# Altium project WackyHatProject.PrjPcb
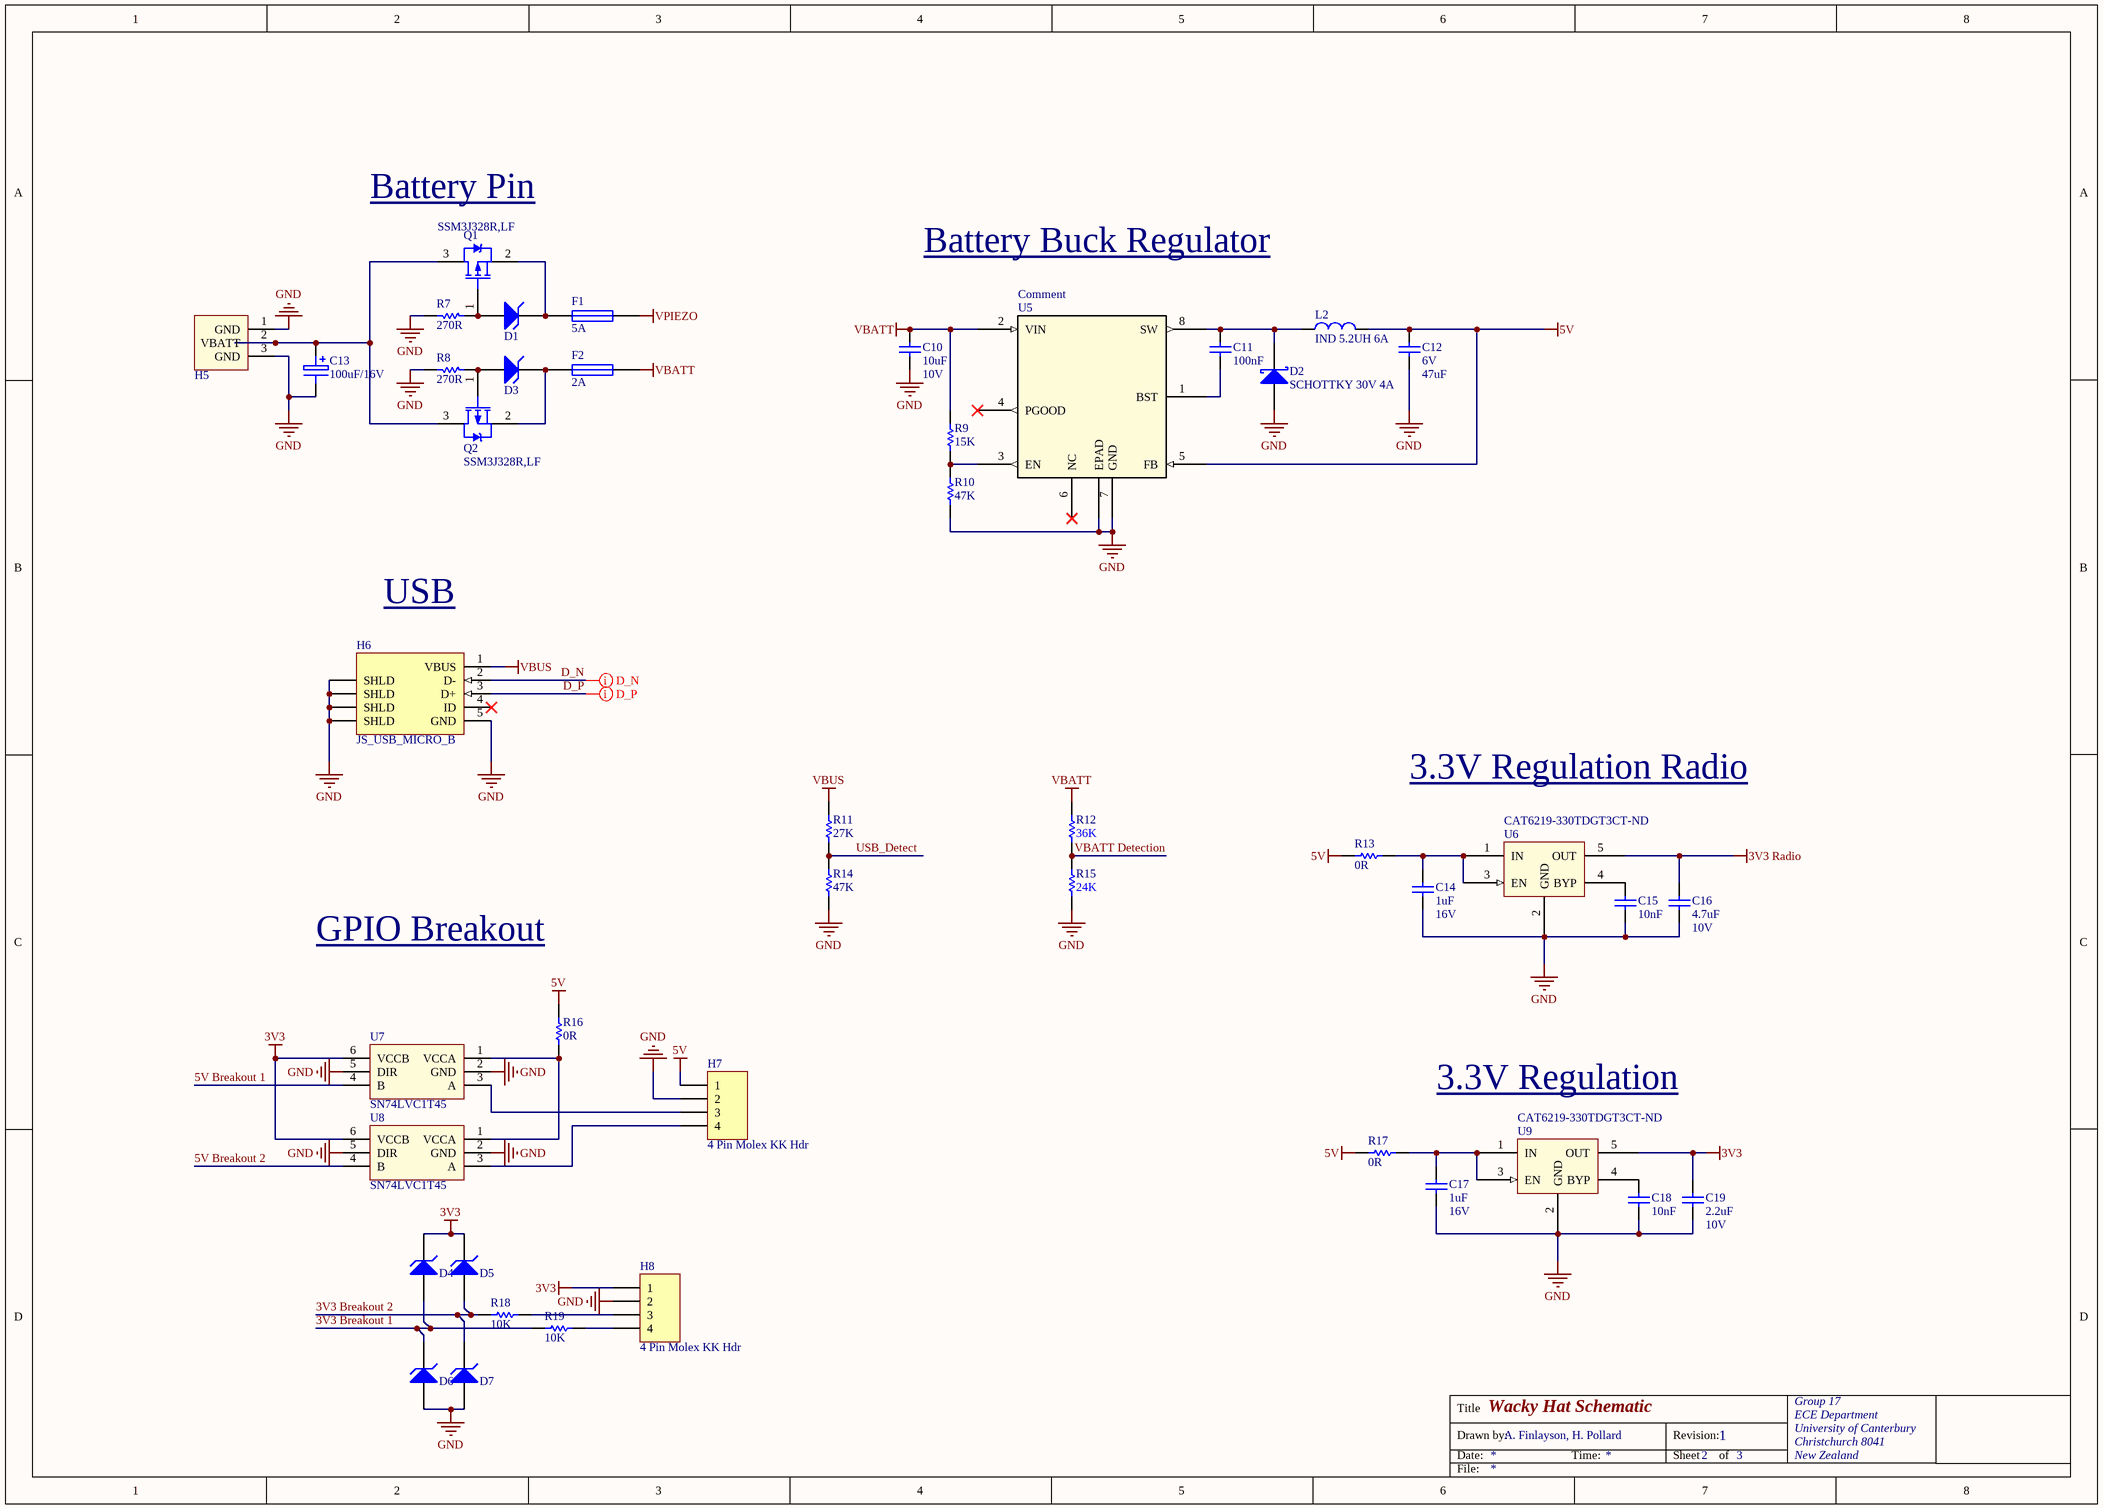
[diagram p0: Power_USB.SchDoc]
3 sheets, 133 parts. Net scope: global (net labels, ports and power ports of the same name join across sheets).
Board file: Hat_Board_PCB.PcbDoc
Sheets:
  Power_USB.SchDoc
  SAM4S_Piezo_LED.SchDoc
  IMU_Radio.SchDoc

## Sheet Power_USB.SchDoc: Wacky Hat Schematic
size A3; DrawnBy: A. Finlayson, H. Pollard; Organization: Group 17; Address1: ECE Department; Address2: University of Canterbury; Address3: Christchurch 8041; Address4: New Zealand; Revision: 1; SheetNumber: 2; SheetTotal: 3

### Parts
C10  Max Voltage: 10V  [CAPC2012L]  (hidden comment: 10uF)
C11  100nF  [CAPC1608L]
C12  Max Voltage: 6V  [CAPC3216L]  (hidden comment: 47uF)
C13  100uF/16V  [NICH-1]
C14  Max Voltage: 16V  [CAPC1608L]  (hidden comment: 1uF)
C15  10nF  [CAPC1608L]
C16  Max Voltage: 10V  [CAPC1608N]  (hidden comment: 4.7uF)
C17  Max Voltage: 16V  [CAPC1608L]  (hidden comment: 1uF)
C18  10nF  [CAPC1608L]
C19  Max Voltage: 10V  [CAPC1608L]  (hidden comment: 2.2uF)
D1  DIODE ZENER 5.6V  [DO-214AA_SCL]  (value not drawn)
D2  SCHOTTKY 30V 4A  [SMC]
D3  DIODE ZENER 5.6V  [DO-214AA_SCL]  (value not drawn)
D4  DIODE ZENER 5.6V  [DO-214AA_SCL]  (value not drawn)
D5  DIODE ZENER 5.6V  [DO-214AA_SCL]  (value not drawn)
D6  DIODE ZENER 5.6V  [DO-214AA_SCL]  (value not drawn)
D7  DIODE ZENER 5.6V  [DO-214AA_SCL]  (value not drawn)
F1  5A  [RESC3216N]
F2  2A  [RESC3216N]
H5  Battery_HEADER_3pin  [BATT_HEADER_3POS]  (value not drawn)
H6  JS_USB_MICRO_B  [FCI_USB_10118194-0001LF]
H7  4 Pin Molex KK Hdr  [MOLEX_KK_4_HDR]
H8  4 Pin Molex KK Hdr  [MOLEX_KK_4_HDR]
L2  IND 5.2UH 6A  [INDUCTOR5u2]
Q1  SSM3J328R,LF  [SOT23_L]
Q2  SSM3J328R,LF  [SOT23_L]
R7  270R  [RESC1608L]
R8  270R  [RESC1608L]
R9  15K  [RESC1608L]
R10  47K  [RESC1608N]
R11  27K  [RESC1608L]
R12  36K  [RESC1608L]
R13  0R  [RESC1608L]
R14  47K  [RESC1608L]
R15  24K  [RESC1608L]
R16  0R  [RESC1608L]
R17  0R  [RESC1608L]
R18  10K  [RESC1608L]
R19  10K  [RESC1608L]
U5  Comment  [RD_8_1]
U6  Supplier Part Number: CAT6219-330TDGT3CT-ND  [SOT95P280X145-5N]  (hidden comment: CAT6219-330TDGT3)
U7  SN74LVC1T45  [SOT23-6_N]
U8  SN74LVC1T45  [SOT23-6_N]
U9  Supplier Part Number: CAT6219-330TDGT3CT-ND  [SOT95P280X145-5N]  (hidden comment: CAT6219-330TDGT3)

### Nets
3V3: C19.2 D4.1(K) D5.1(K) H8.1 U7.6(VCCB) U8.6(VCCB) U9.5(OUT)
3V3 Radio: C16.2 U6.5(OUT)
5V: C12.2 H7.1 L2.2 R13.1 R16.2 R17.1 U5.5(FB)
GND: C10.1 C12.1 C13.1 C14.1 C15.1 C16.1 C17.1 C18.1 C19.1 D2.1(A) D6.2(A) D7.2(A) H5.1(GND) H5.3(GND) H6.5(GND) H6.6(SHLD) H7.2 H8.2 R7.1 R8.1 R10.1 R14.1 R15.1 U5.7(GND) U5.EPAD U6.2(GND) U7.2(GND) U7.5(DIR) U8.2(GND) U8.5(DIR) U9.2(GND)
VBATT: C10.2 F2.2 R9.2 R12.2 U5.2(VIN)
VBUS: H6.1(VBUS) R11.2
VPIEZO: F1.2
3V3 Breakout 1: D4.2(A) D6.1(K) R19.1
3V3 Breakout 2: D5.2(A) D7.1(K) R18.1
5V Breakout 1: U7.4(B)
5V Breakout 2: U8.4(B)
D_N: H6.2(D-)
D_P: H6.3(D+)
USB_Detect: R11.1 R14.2
VBATT Detection: R12.1 R15.2
NetC11_1: C11.1 U5.1(BST)
NetC11_2: C11.2 D2.2(K) L2.1 U5.8(SW)
NetC13_2: C13.2 H5.2(VBATT) Q1.3 Q2.3
NetC14_2: C14.2 R13.2 U6.1(IN) U6.3(EN)
NetC15_2: C15.2 U6.4(BYP)
NetC17_2: C17.2 R17.2 U9.1(IN) U9.3(EN)
NetC18_2: C18.2 U9.4(BYP)
NetD1_1: D1.1(K) F1.1 Q1.2
NetD1_2: D1.2(A) Q1.1 R7.2
NetD3_1: D3.1(K) F2.1 Q2.2
NetD3_2: D3.2(A) Q2.1 R8.2
NetH7_3: H7.3 U7.3(A)
NetH7_4: H7.4 U8.3(A)
NetH8_3: H8.3 R18.2
NetH8_4: H8.4 R19.2
NetR9_1: R9.1 R10.2 U5.3(EN)
NetR16_1: R16.1 U7.1(VCCA) U8.1(VCCA)

Not connected (* = marked no-connect by the designer): H6 4(ID)*; U5 4(PGOOD)* 6(NC)*

### Layout directives
differential pair: D_N, D_P

### Notes on the sheet
- Battery Pin
- Battery Buck Regulator
- USB
- 3.3V Regulation Radio
- GPIO Breakout
- 3.3V Regulation
- Title
- Drawn by:
- Date:
- Time:
- Revision:
- Sheet
- of
- File:

### Library data of the parts
C10 = CC_10uF_0805_10V: CAP CER 10uF X7R +-20% 10V 0805; Note: Footprint corresponds to dimensions for bulk cassette packaging. This case size has tightened tolerances.; PackageReference: 0805; Code_IPC: 2012[0805]; Verify: *; Supplier: ECE Dept; Storage Location: PCB Assembly WS; Value: 10uF
C11 = CC_100nF_0603: CAP CER 100nF X7R +-10% 50V 0603; PackageReference: 0603; Code_IPC: 1608 [0603]; Verify: *; Supplier: ECE Dept; Storage Location: PCB Assembly WS; Value: 100nF
C12 = CC_47uF_1206: CAP CER 47uF X5R -/+20% 6V 1206; Verify: *; Supplier: ECE Dept; Storage Location: PCB Assembly WS; Dielectric: X5R; Footprint: 1210 (3225 metric); MoV: 6V; Value: 47uF
C13 = CA_100uF_16V: CAP ALUM 100uF 16V SMD; Manufacturer PN: UWX1C101MCL1GB; Manufacturer: Nichcon; Supplier 1: Farnell; Supplier Part Number 1: 1870677; Storage Location: PCB Assembly WS; Supplier: ECE Dept; Supplier 2: Digi-Key; Supplier Part Number 2: 493-2105-1-ND; Value: 100uF/16V
C14 C17 = CC_1uF_0603: CAP CER 1uF Y5V -20% +80% 16V 0603; PackageReference: 0603; Code_IPC: 1608 [0603]; Verify: *; Supplier: ECE Dept; Storage Location: PCB Assembly WS; Value: 1uF
C15 C18 = CC_10nF_0603: CAP CER 10nF X7R +-10% 50V 0603; PackageReference: 0603; Code_IPC: 1608 [0603]; Verify: *; Supplier: ECE Dept; Storage Location: PCB Assembly WS; Value: 10nF
C16 = CC_4.7uF_0603: CAP CER 4.7uF X5R +-20%  10V 0603; Note: Footprint corresponds to dimensions for bulk cassette packaging. This case size has tightened tolerances.; PackageReference: 0805; Code_IPC: 2012[0805]; Verify: *; Supplier: ECE Dept; Storage Location: PCB Assembly WS; Value: 4.7uF
C19 = CC_2.2uF_0603: CAP CER 2.2uF X5R +-20% 10V 0603; PackageReference: 0603; Code_IPC: 1608 [0603]; Verify: *; Supplier: ECE Dept; Storage Location: PCB Assembly WS; Value: 2.2uF
D1 D3-D7 = SMBJ5339B-TP: DIODE ZENER 5.6V 5W DO214AA; Manufacturer: Micro Commercial Co; Tolerance: ±5%; Supplier 1: Digi-Key; Manufacturer Part Number: SMBJ5339B-TP; RoHS: RoHS Compliant; Category: Discrete Semiconductor Products; Stock 1: 85990; Pricing 1: 1=1.47, 10=1.277, 25=1.1312, 100=0.9853, 250=0.85764, 500=0.72988, 1000=0.58391 (NZD); Packaging: Cut Tape (CT); Part Status: Active; Operating Temperature: -55°C ~ 150°C; Mounting Type: Surface Mount; Package / Case: DO-214AA, SMB; Supplier Device Package: DO-214AA (SMB); Base Part Number: SMBJ5339; ComponentLink1URL: http://www.mccsemi.com/up_pdf/SMBJ5338B-SMBJ5388B(SMB).pdf; ComponentLink1Description: http://www.mccsemi.com/up_pdf/SMBJ5338B-SMBJ5388B(SMB).pdf; Supplier Part Number 1: SMBJ5339B-TPMSCT-ND
D2 = MBRS330T3G: DIODE SCHOTTKY 30V 4A SMC; Manufacturer: ON Semiconductor; Speed: Fast Recovery =< 500ns, > 200mA (Io); Supplier 1: Digi-Key; Manufacturer Part Number: MBRS330T3G; RoHS: RoHS Compliant; Category: Discrete Semiconductor Products; Stock 1: 8919; Pricing 1: 1=0.93, 10=0.79, 100=0.5902, 500=0.46368, 1000=0.35829 (NZD); Packaging: Cut Tape (CT); Part Status: Active; Diode Type: Schottky; Current - Average Rectified (Io): 4A; Capacitance @ Vr, F: -; Mounting Type: Surface Mount; Package / Case: DO-214AB, SMC; Supplier Device Package: SMC; Operating Temperature - Junction: -65°C ~ 150°C; Base Part Number: MBRS330; ComponentLink1URL: http://www.onsemi.com/pub/Collateral/MBRS340T3-D.PDF; ComponentLink1Description: http://www.onsemi.com/pub/Collateral/MBRS340T3-D.PDF; Supplier Part Number 1: MBRS330T3GOSCT-ND
F1 = FS_Fuse_5.0A: Fuse 5.0A Fast Acting 1206 SMD; Manufacturer Part Number: C1F5; Manufacturer: Bel TRP; Voltage Rating (AC): 125V; Voltage Rating (DC): 63V; DC Cold Resistance: 19mR; Fuse Type: Board Mount (Cartridge Style Excluded); Approvals: CE,cURus; Mount: Surface Mount; Case/Package: 1206; Number of Pins: 2; Case Code (Metric): 3216; Case Code (Imperial): 1206; Contact Plating: Nickel,Tin; Min Operating Temperature: -55°C; Max Operating Temperature: 125°C; Packaging: Tape and Reel; Voltage Rating: 125V; Length: 0.126inch; Width: 0.062inch; Supplier 1: Digi-Key; Stock 1: 725; Pricing 1: 1=0.32, 5=0.312, 10=0.298, 50=0.2662, 100=0.2479, 250=0.22032, 500=0.1836, 1000=0.17442 (USD); ComponentLink1URL: http://www.farnell.com/datasheets/2571625.pdf; ComponentLink1Description: http://www.farnell.com/datasheets/2571625.pdf; ComponentLink2URL: http://belfuse.com/pdfs/C1F.pdf; ComponentLink2Description: http://belfuse.com/pdfs/C1F.pdf; ComponentLink3URL: http://www.mouser.com/ds/2/643/C1F-594910.pdf; ComponentLink3Description: http://www.mouser.com/ds/2/643/C1F-594910.pdf; ComponentLink4URL: https://belfuse.com/resources/StewartConnector/C1F.pdf; ComponentLink4Description: https://belfuse.com/resources/StewartConnector/C1F.pdf; Current Rating: 5A; Supplier Part Number 1: 507-1886-1-ND; Supplier 2: Element14; Supplier Part Number 2: 2848595; Value: 5A
F2 = FS_Fuse_2.0A: Fuse 2.0A Very Fast Acting 1206 SMD; Manufacturer: MULTICOMP; Manufacturer PN: MC12CF 002; Supplier: ECE Dept; Storage Location: PCB Assembly WS; Supplier 1: Farnell; Supplier Part Number 1: 1841029; Manufacturer Part Number: MC12CF 002; Value: 2A
H5 = Battery_HEADER_3pin: 3Pin Header 2.54mm spacing
H6 = JS_USB_MICRO_B_SMT: CONN USB MICRO B RECPT SMT R/A; Manufacturer: FCI; Manufacturer Part Number: 10118194-0001LF; Gender: Receptacle; Number of Contacts: 5; Specifications: USB 2.0; Supplier 1: Digi-Key; Supplier Part Number 1: 609-4618-1-ND; Features: Shielded, Solder Retention; Mounting Type: Surface Mount, Right Angle, Horizontal
H7 H8 = JA_MOLEX_KK_4POS: CONN HEADER 4POS 2.54mm VERT_Thru Hole; Manufacturer: Molex; Manufacturer PN: 22-23-2041; Supplier Part Number 1: 9731164; Supplier: ECE Dept; Supplier 1: Farnell; Storage Location: ECE Dept Store; Value: 4 Pin Molex KK Hdr
L2 = CDRH104RNP-5R2NC: FIXED IND 5.2UH 6A 22 MOHM SMD; Manufacturer: Sumida America Components Inc.; Material - Core: Ferrite; Tolerance: ±30%; Current - Saturation: 5.6A; Shielding: Shielded; DC Resistance (DCR): 22 mOhm Max; Supplier 1: Digi-Key; Manufacturer Part Number: CDRH104RNP-5R2NC; RoHS: RoHS Compliant; Category: Inductors, Coils, Chokes; Stock 1: 3849; Pricing 1: 1=2.9, 10=2.678, 100=1.8743, 500=1.5173 (NZD); Packaging: Cut Tape (CT); Part Status: Active; Type: -; Q @ Freq: -; Frequency - Self Resonant: -; Ratings: -; Operating Temperature: -40°C ~ 100°C; Mounting Type: Surface Mount; Package / Case: Nonstandard; Supplier Device Package: -; Size / Dimension: 0.402" L x 0.394" W (10.20mm x 10.00mm); Height - Seated (Max): 0.157" (4.00mm); ComponentLink1URL: http://products.sumida.com/products/pdf/CDRH104R.pdf; ComponentLink1Description: http://products.sumida.com/products/pdf/CDRH104R.pdf; Supplier Part Number 1: 308-2280-1-ND
Q1 Q2 = TM_SSM3J328R: MOSFET P-CH 20V 6A SOT23-3; Manufacturer: Toshiba; FET Feature: Logic Level Gate, 1.5V Drive; FET Type: MOSFET P-Channel, Metal Oxide; Gate Charge (Qg) @ Vgs: 12.8nC @ 4.5V; Input Capacitance (Ciss) @ Vds: 840pF @ 10V; Power - Max: 1W; Rds On Max: 29.8mR; Drain to Source Resistance: 47.4mR; Turn-On Delay Time: 32ns; Power Dissipation: 2W; Number of Channels: 1; Turn-Off Delay Time: 107ns; Gate to Source Voltage (Vgs): 8V; Input Capacitance: 840pF; Element Configuration: Single; Drain to Source Breakdown Voltage: -20V; Vgs(th) (Max) @ Id: 1V @ 1mA; Current - Continuous Drain (Id) @ 25° C: 6A; Drain to Source Voltage (Vdss): 20V; Package / Case: SOT-23-3 Flat Leads; Supplier Device Package: SOT-23F; Pricing: 1=0.79, 10=0.658, 25=0.5772, 100=0.4939, 250=0.42836, 500=0.36284, 1000=0.27972 (NZD); Storage Location: PCB Assembly WS; Supplier: Digi-Key; ComponentLink1URL: https://datasheet.ciiva.com/11158/ssm3j328r-datasheet-en-20140301-11158652.pdf; ComponentLink1Description: https://datasheet.ciiva.com/11158/ssm3j328r-datasheet-en-20140301-11158652.pdf; Supplier Part Number: SSM3J328RLFDKR-ND; Max Operating Temperature: 150°C; Mount: Surface Mount; Packaging: Tape and Reel; Min Operating Temperature: -55°C; Continuous Drain Current (ID): 6A; Radiation Hardening: No; Max Power Dissipation: 1W; Package Quantity: 3000; Case/Package: SOT-23-3; Number of Pins: 3; Number of Elements: 1; Supplier 1: Digi-Key; Supplier Part Number 1: SSM3J328RLFDKR-ND; Manufacturer Part Number: SSM3J328R,LF
R7 R8 = RS_270R: RES 270 OHM 1/10W 5% 0603 SMD; Storage Location: PCB Assembly WS; Supplier: ECE Dept; Value: 270R
R9 = RS_15K: RES 15.0K OHM 1/10W 5% 0603 SMD; Storage Location: PCB Assembly WS; Supplier: ECE Dept; Value: 15K
R10 R14 = RS_47K: RES 47.0K OHM 1/10W 5% 0603 SMD; Storage Location: PCB Assembly WS; Supplier: ECE Dept; Value: 47K
R11 = RS_27K: RES 27K OHM 1/10W 5% 0603 SMD; Storage Location: PCB Assembly WS; Supplier: ECE Dept; Value: 27K
R12 = RS_36K: RES 36K OHM 1/10W 5% 0603 SMD; Storage Location: PCB Assembly WS; Supplier: ECE Dept; Value: 36K
R13 R16 R17 = RS_0R0: RES 0.0 OHM 1/10W 5% 0603 SMD; Storage Location: PCB Assembly WS; Supplier: ECE Dept; Value: 0R
R15 = RS_24K: RES 24K OHM 1/10W 5% 0603 SMD; Storage Location: PCB Assembly WS; Supplier: ECE Dept; Value: 24K
R18 R19 = RS_10K: RES 10.0K OHM 1/10W 5% 0603 SMD; Storage Location: PCB Assembly WS; Supplier: ECE Dept; Value: 10K
U5 = ADP2302ARDZ-5.0-R7: IC REG BUCK 5V 2A 8SOIC; Vendor: Analog Devices Inc; Frequency - Switching: 700kHz; Output Type: Fixed; Voltage - Input (Max): 20V; Manufacturer_Part_Number: ADP2302ARDZ-5.0-R7; Type: DEV; Value: Value; Supplier 1: Digi-Key; Current - Output: 2A; Voltage - Output (Min/Fixed): 5V; Supplier Part Number 1: ADP2302ARDZ-5.0-R7CT-ND
U6 U9 = SV_CAT6219-330TDGT3: IC REG LIN 3.3V 500MA TSOT23-5; Voltage - Input (Max): 5.5V; Voltage Dropout (Max): 0.5V @ 500mA; Manufacturer Part Number: CAT6219-330TDGT3; Base Part Number: CAT6219; Current - Output: 500mA; Package / Case: SOT-23-5 Thin, TSOT-23-5; Supplier: Digi-Key; Supplier Device Package: TSOT-23-5; Voltage - Output (Min/Fixed): 3.3V; ComponentLink1URL: http://www.onsemi.com/pub/Collateral/CAT6219-D.PDF; ComponentLink1Description: http://www.onsemi.com/pub/Collateral/CAT6219-D.PDF; Supplier 1: Digi-Key
U7 U8 = SN74LVC1T45: 1.8V - 5V level converter

## Sheet SAM4S_Piezo_LED.SchDoc: Wacky Hat Schematic
size A3; DrawnBy: A. Finlayson, H. Pollard; Organization: Group 17; Address1: ECE Department; Address2: University of Canterbury; Address3: Christchurch 8041; Address4: New Zealand; Revision: 1; SheetNumber: 3; SheetTotal: 3
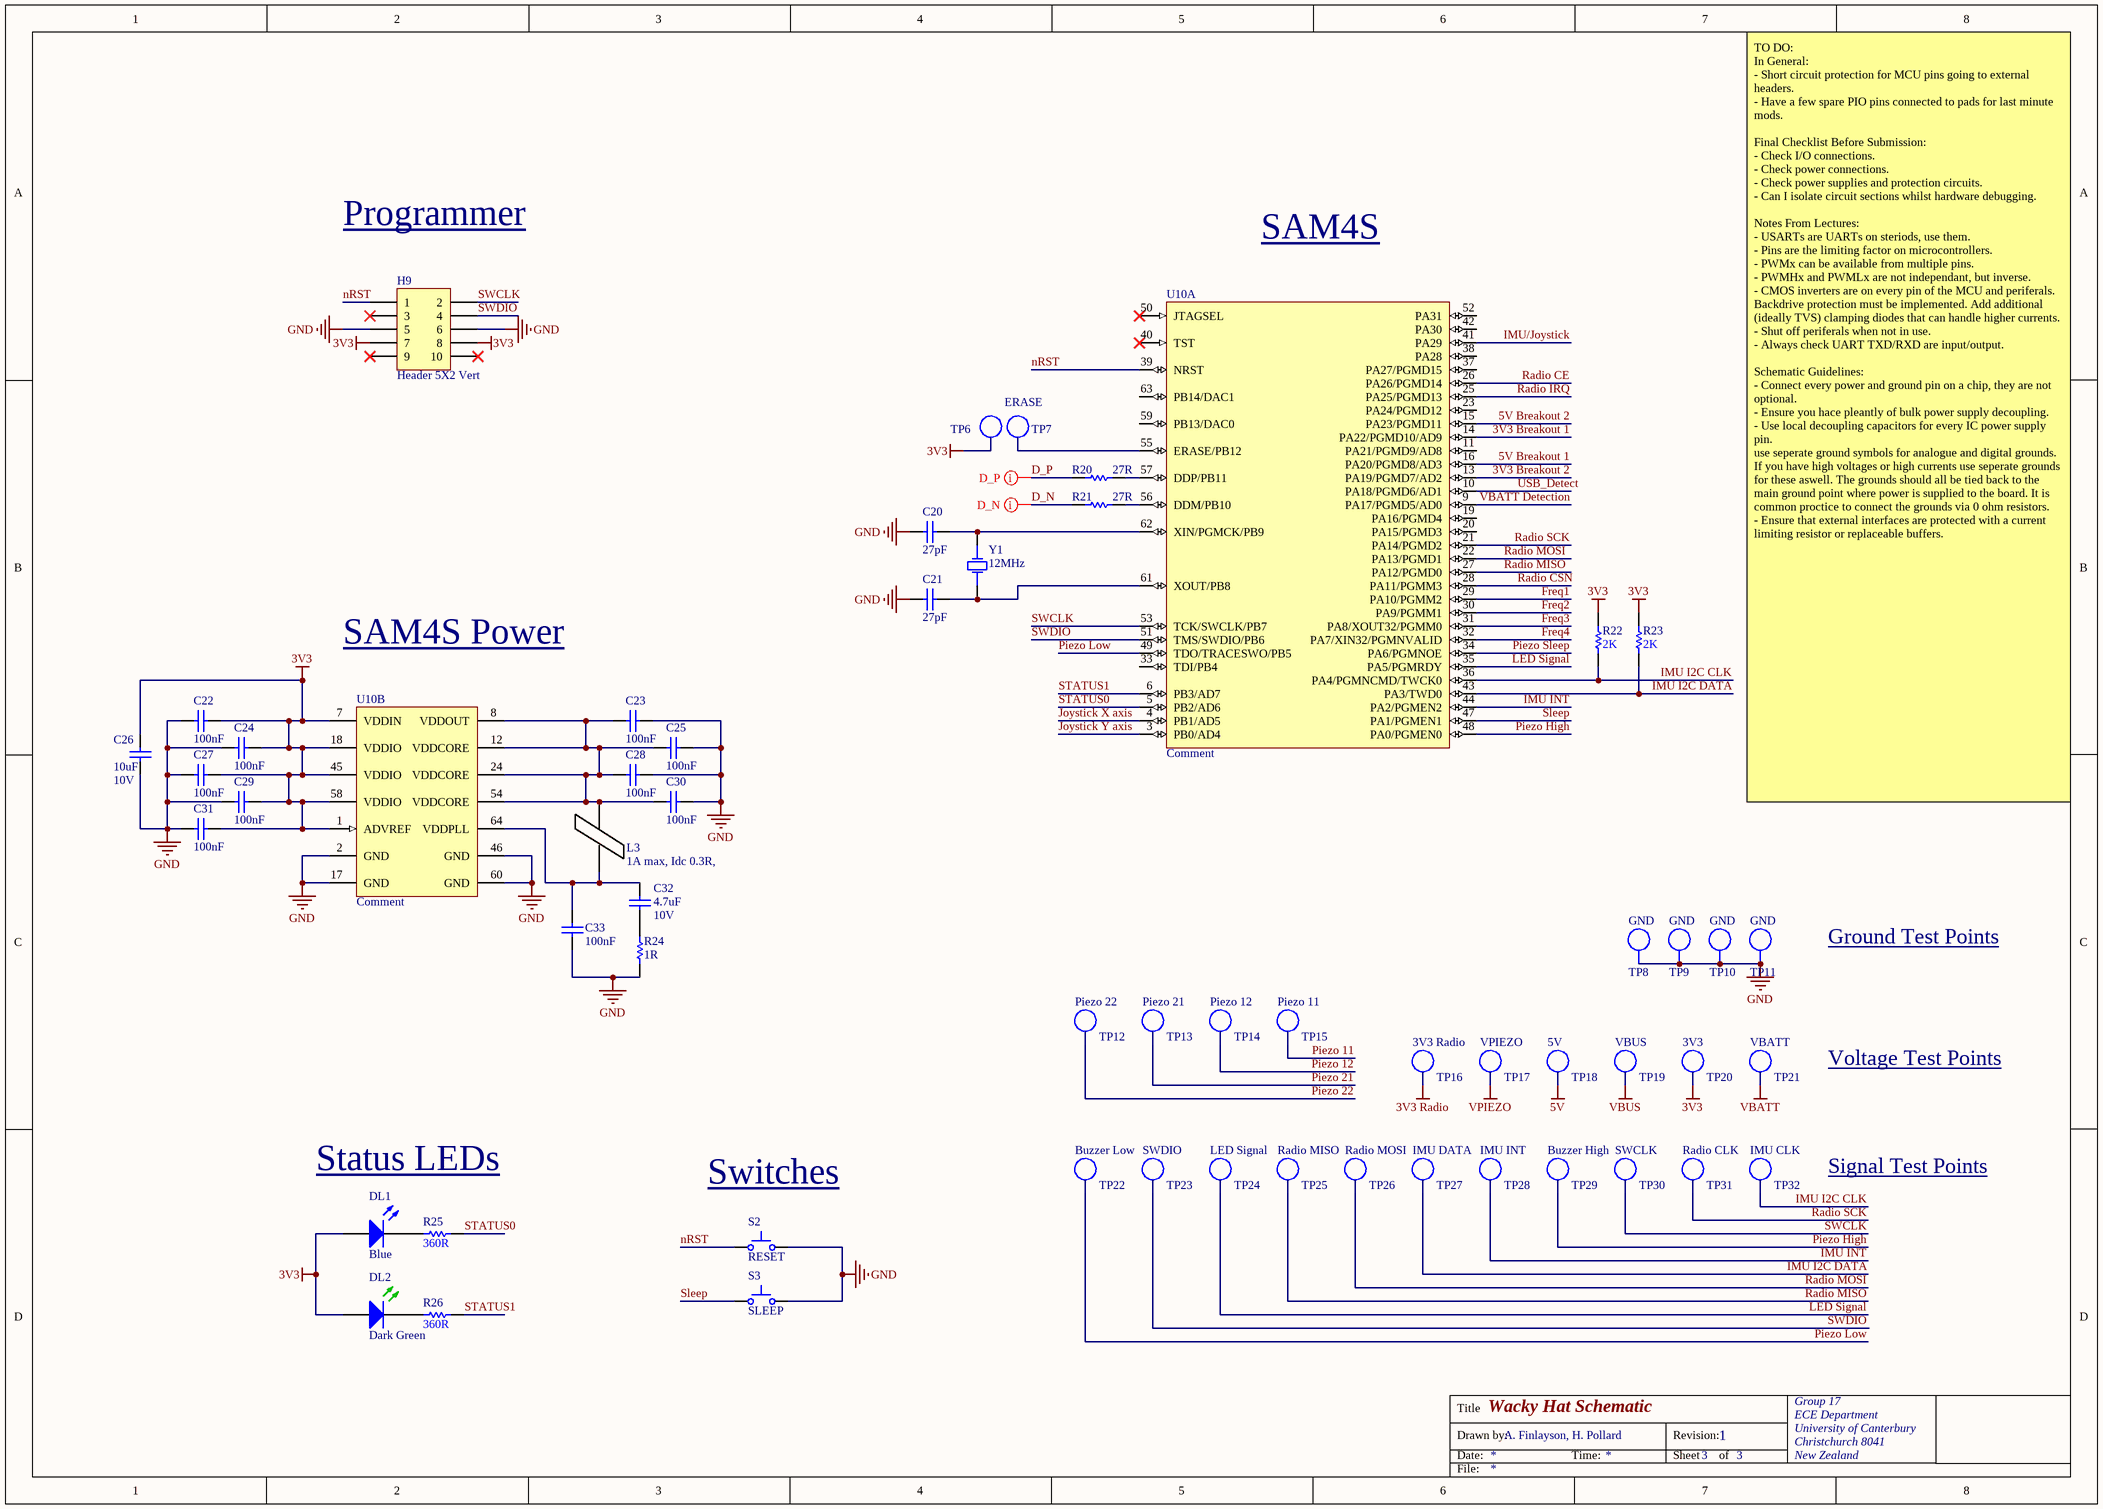
[diagram p1: SAM4S_Piezo_LED.SchDoc]

### Parts
C20  27pF  [CAPC1608L]
C21  27pF  [CAPC1608L]
C22  100nF  [CAPC1608L]
C23  100nF  [CAPC1608L]
C24  100nF  [CAPC1608L]
C25  100nF  [CAPC1608L]
C26  Max Voltage: 10V  [CAPC2012L]  (hidden comment: 10uF)
C27  100nF  [CAPC1608L]
C28  100nF  [CAPC1608L]
C29  100nF  [CAPC1608L]
C30  100nF  [CAPC1608L]
C31  100nF  [CAPC1608L]
C32  Max Voltage: 10V  [CAPC1608N]  (hidden comment: 4.7uF)
C33  100nF  [CAPC1608L]
DL1  Blue  [WL-SMCW0603]
DL2  Dark Green  [WL-SMCW0603]
H9  Header 5X2 Vert  [IDC2.54-V10D]
L3  1A max, Idc 0.3R,  [INDC3216L]
R20  27R  [RESC1608L]
R21  27R  [RESC1608L]
R22  2K  [RESC1608L]
R23  2K  [RESC1608L]
R24  1R  [RESC3216L]
R25  360R  [RESC1608L]
R26  360R  [RESC1608L]
S2  RESET  [EVQPNF05M]
S3  SLEEP  [EVQPNF05M]
TP6  TP_0603  [TP_0603]  (value not drawn)
TP7  ERASE  [TP_0603]
TP8  GND  [TP_1206]  (no BOM)
TP9  GND  [TP_1206]  (no BOM)
TP10  GND  [TP_1206]  (no BOM)
TP11  GND  [TP_1206]  (no BOM)
TP12  Piezo 22  [TP_0603]
TP13  Piezo 21  [TP_0603]
TP14  Piezo 12  [TP_0603]
TP15  Piezo 11  [TP_0603]
TP16  3V3 Radio  [TP_0603]
TP17  VPIEZO  [TP_0603]
TP18  5V  [TP_0603]
TP19  VBUS  [TP_0603]
TP20  3V3  [TP_0603]
TP21  VBATT  [TP_0603]
TP22  Buzzer Low  [TP_0603]
TP23  SWDIO  [TP_0603]
TP24  LED Signal  [TP_0603]
TP25  Radio MISO  [TP_0603]
TP26  Radio MOSI  [TP_0603]
TP27  IMU DATA  [TP_0603]
TP28  IMU INT  [TP_0603]
TP29  Buzzer High  [TP_0603]
TP30  SWCLK  [TP_0603]
TP31  Radio CLK  [TP_0603]
TP32  IMU CLK  [TP_0603]
U10  Comment  [LQFP64_L]  (parts A,B of 2)
Y1  12MHz  [6.0X3.5-4]

### Nets
3V3: C22.2 C24.2 C26.2 C27.2 C29.2 C31.2 DL1.2(A) DL2.2(A) H9.7 H9.8 R22.2 R23.2 TP6.1(TP) TP20.1(TP) U10.1(ADVREF) U10.7(VDDIN) U10.18(VDDIO) U10.45(VDDIO) U10.58(VDDIO)
3V3 Radio: TP16.1(TP)
5V: TP18.1(TP)
GND: C20.1 C21.1 C22.1 C23.2 C24.1 C25.2 C26.1 C27.1 C28.2 C29.1 C30.2 C31.1 C33.1 H9.5 H9.6 R24.1 S2.2 S3.2 TP8.1 TP9.1 TP10.1 TP11.1 U10.2(GND) U10.17(GND) U10.46(GND) U10.60(GND)
VBATT: TP21.1(TP)
VBUS: TP19.1(TP)
VPIEZO: TP17.1(TP)
3V3 Breakout 1: U10.14(PA22/PGMD10/AD9)
3V3 Breakout 2: U10.13(PA19/PGMD7/AD2)
5V Breakout 1: U10.16(PA20/PGMD8/AD3)
5V Breakout 2: U10.15(PA23/PGMD11)
D_N: R21.1
D_P: R20.1
Freq1: U10.29(PA10/PGMM2)
Freq2: U10.30(PA9/PGMM1)
Freq3: U10.31(PA8/XOUT32/PGMM0)
Freq4: U10.32(PA7/XIN32/PGMNVALID)
IMU I2C CLK: R22.1 TP32.1(TP) U10.36(PA4/PGMNCMD/TWCK0)
IMU I2C DATA: R23.1 TP27.1(TP) U10.43(PA3/TWD0)
IMU INT: TP28.1(TP) U10.44(PA2/PGMEN2)
IMU/Joystick: U10.41(PA29)
Joystick X axis: U10.4(PB1/AD5)
Joystick Y axis: U10.3(PB0/AD4)
LED Signal: TP24.1(TP) U10.35(PA5/PGMRDY)
nRST: H9.1 S2.1 U10.39(NRST)
Piezo 11: TP15.1(TP)
Piezo 12: TP14.1(TP)
Piezo 21: TP13.1(TP)
Piezo 22: TP12.1(TP)
Piezo High: TP29.1(TP) U10.48(PA0/PGMEN0)
Piezo Low: TP22.1(TP) U10.49(TDO/TRACESWO/PB5)
Piezo Sleep: U10.34(PA6/PGMNOE)
Radio CE: U10.26(PA26/PGMD14)
Radio CSN: U10.28(PA11/PGMM3)
Radio IRQ: U10.25(PA25/PGMD13)
Radio MISO: TP25.1(TP) U10.27(PA12/PGMD0)
Radio MOSI: TP26.1(TP) U10.22(PA13/PGMD1)
Radio SCK: TP31.1(TP) U10.21(PA14/PGMD2)
Sleep: S3.1 U10.47(PA1/PGMEN1)
STATUS0: R25.2 U10.5(PB2/AD6)
STATUS1: R26.2 U10.6(PB3/AD7)
SWCLK: H9.2 TP30.1(TP) U10.53(TCK/SWCLK/PB7)
SWDIO: H9.4 TP23.1(TP) U10.51(TMS/SWDIO/PB6)
USB_Detect: U10.10(PA18/PGMD6/AD1)
VBATT Detection: U10.9(PA17/PGMD5/AD0)
NetC20_2: C20.2 U10.62(XIN/PGMCK/PB9) Y1.3(OSC2)
NetC21_2: C21.2 U10.61(XOUT/PB8) Y1.1(OSC1)
NetC23_1: C23.1 C25.1 C28.1 C30.1 L3.2 U10.8(VDDOUT) U10.12(VDDCORE) U10.24(VDDCORE) U10.54(VDDCORE)
NetC32_1: C32.1 R24.2
NetC32_2: C32.2 C33.2 L3.1 U10.64(VDDPLL)
NetDL1_1: DL1.1(K) R25.1
NetDL2_1: DL2.1(K) R26.1
NetR20_2: R20.2 U10.57(DDP/PB11)
NetR21_2: R21.2 U10.56(DDM/PB10)
NetTP7_1: TP7.1(TP) U10.55(ERASE/PB12)

Not connected (* = marked no-connect by the designer): H9 3* 9* 10*; U10 11(PA21/PGMD9/AD8) 19(PA16/PGMD4) 20(PA15/PGMD3) 23(PA24/PGMD12) 33(TDI/PB4) 37(PA27/PGMD15) 38(PA28) 40(TST)* 42(PA30) 50(JTAGSEL)* 52(PA31) 59(PB13/DAC0) 63(PB14/DAC1)

### Layout directives
differential pair: D_N, D_P

### Notes on the sheet
- Programmer
- SAM4S
- SAM4S Power
- TO DO:
  In General:
  - Short circuit protection for MCU pins going to external headers.
  - Have a few spare PIO pins connected to pads for last minute mods.
  Final Checklist Before Submission:
  - Check I/O connections.
  - Check power connections.
  - Check power supplies and protection circuits.
  - Can I isolate circuit sections whilst hardware debugging.
  Notes From Lectures:
  - USARTs are UARTs on steriods, use them.
  - Pins are the limiting factor on microcontrollers.
  - PWMx can be available from multiple pins.
  - PWMHx and PWMLx are not independant, but inverse.
  - CMOS inverters are on every pin of the MCU and periferals. Backdrive protection must be implemented. Add additional (ideally TVS) clamping diodes that can handle higher currents.
  - Shut off periferals when not in use.
  - Always check UART TXD/RXD are input/output.
  Schematic Guidelines:
  - Connect every power and ground pin on a chip, they are not optional.
  - Ensure you hace pleantly of bulk power supply decoupling.
  - Use local decoupling capacitors for every IC power supply pin.
  use seperate ground symbols for analogue and digital grounds. If you have high voltages or high currents use seperate grounds for these aswell. The grounds should all be tied back to the main ground point where power is supplied to the board. It is common proctice to connect the grounds via 0 ohm resistors.
  - Ensure that external interfaces are protected with a current limiting resistor or replaceable buffers.
- Ground Test Points
- Voltage Test Points
- Status LEDs
- Switches
- Signal Test Points
- Title
- Drawn by:
- Date:
- Time:
- Revision:
- Sheet
- of
- File:

### Library data of the parts
C20 C21 = CC_27pF_0603: CAP CER 27pF NPO/COG +-5% 50V 0603; PackageReference: 0603; Code_IPC: 1608 [0603]; Verify: *; Supplier: ECE Dept; Storage Location: PCB Assembly WS; Value: 27pF
C22-C25 C27-C31 C33 = CC_100nF_0603: CAP CER 100nF X7R +-10% 50V 0603; PackageReference: 0603; Code_IPC: 1608 [0603]; Verify: *; Supplier: ECE Dept; Storage Location: PCB Assembly WS; Value: 100nF
C26 = CC_10uF_0805_10V: as C10 on sheet Power_USB; PackageReference: 0805; Code_IPC: 2012[0805]; Verify: *; Supplier: ECE Dept; Storage Location: PCB Assembly WS; Value: 10uF
C32 = CC_4.7uF_0603: as C16 on sheet Power_USB; PackageReference: 0805; Code_IPC: 2012[0805]; Verify: *; Supplier: ECE Dept; Storage Location: PCB Assembly WS; Value: 4.7uF
DL1 = DL_150060BS75000: LED Blue 270mcd 0603 SMD; Manufacturer: WURTH ELEKTRONIK; Forward Current If: 30; Forward Voltage: 3.2; Luminous Intensity: 270; Viewing Angle: 120°; Wavelength Typ: 470; Pricing: 1=0.3844, 50=0.3252, 100=0.2957, 500=0.2365 (NZD); Supplier 1: Farnell; Supplier Part Number 1: 2322069; Manufacturer Part Number: 150060BS75000; Storage Location: PCB Assembly WS; Supplier: ECE Dept; LED Colour: Blue
DL2 = DL_150060GS75000: LED Dk Green 430mcd 0603 SMD; Manufacturer: WURTH ELEKTRONIK; Forward Current If: 30; Wavelength Typ: 520; Forward Voltage: 3.2; Lens Shape: Rectangular; Luminous Intensity: 430; Viewing Angle: 140°; LED Mounting: SMD; Supplier 1: Farnell; Supplier Part Number 1: 2322070; Manufacturer Part Number: 150060GS75000; Storage Location: PCB Assembly WS; Supplier: ECE Dept; LED Colour: Dark Green
H9 = JA_HDR_IDC_5X2_VERT: IDC Header, 2,54mm, 10-Pin, Vert; Supplier: ECE Dept; Supplier 1: Farnell; Supplier Part Number 1: 1096985; Storage Location: ECE Dept Store
L3 = IN_Ferrite-Bead: Ferrite Bead, Rdc 0.3R, Z100MHZ 600R, Imax 1A, SMD 1206; Manufacturer: FAIR-RITE; Manufacturer PN: 2512066017Y1; DC Current Rating: 1; DC Resistance Max: 0.08; Ferrite Case Style: 1206 ^3216 Metric]; Frequency Range: 50MHz to 1; Impedance: 600; Impedance Tolerance: ± 25%; Supplier: ECE Dept; Storage Location: PCB Assembly WS; Ferrite Mounting: SMD; Supplier 1: Farnell; Supplier Part Number 1: 1612060; Manufacturer Part Number: 2512066017Y1; Value: 1A max, Idc 0.3R,
R20 R21 = RS_27R: RES 27 OHM 1/10W 5% 0603 SMD; Storage Location: PCB Assembly WS; Supplier: ECE Dept; Value: 27R
R22 R23 = RS_2K: RES 2K OHM 1/10W 5% 0603 SMD; Storage Location: PCB Assembly WS; Supplier: ECE Dept; Value: 2K
R24 = RT_1R: RES 1R OHM 1/4W 5% 1206 SMD; Storage Location: PCB Assembly WS; Supplier: ECE Dept; Value: 1R
R25 R26 = RS_360R: RES 360 OHM 1/10W 5% 0603 SMD; Storage Location: PCB Assembly WS; Supplier: ECE Dept; Value: 360R
S2 S3 = WS_EVQPNF05M: Panasonic 6 x 3.5mm SMD Light Touch Switch Type SMD; PackageDescription: 6.0 x 3.5 mm; Supplier 1: Farnell; Supplier Part Number 1: 2079481; Manufacturer: Panasonic; Manufacturer PN: EVQPNF05M; Supplier 2: Digi-Key; Supplier Part Number 2: P13598SCT-ND; Storage Location: PCB Assembly WS; Supplier: ECE Dept
TP6 TP7 TP12-TP32 = TP_0603: Test Point 1.65X0.9X1.2mm SMD; Manufacturer: TE Connectivity AMP Connectors; Manufacturer Part Number: 1625854-3; Mounting Type: Surface Mount; Type: PC Test Point; Supplier 1: Digi-Key; Supplier Part Number 1: A106145CT-ND; Terminal: 0.063" x 0.031" x 0.045" (1.60mm x 0.80mm x 1.15mm)
TP8-TP11 = TP_1206: Test-Point 3.3x1.6x2.1mm SMD; Manufacturer: Harwin Inc; Manufacturer Part Number: S1751-46R; Value: TP; Manufacturer PN: *; Storage Location: ProtoPlace; Mounting Type: Surface Mount; Type: PC Test Point; Supplier 1: Digi-Key; Supplier Part Number 1: 952-1478-2-ND; Supplier 2: Farnell; Supplier Part Number 2: 1826282; Supplier: ECE Dept
U10 = SE_ATSAM4S16BA-MU: IC MCU 32BIT 512KB FLASH 64LQFP; Manufacturer: Atmel; Manufacturer Part Number: ATSAM4S8BA-ANR; Connectivity: I²C, IrDA, Memory Card, SPI, SSC, UART/USART, USB; Core Processor: ARM® Cortex®-M4; Core Size: 32-Bit; Data Converters: A/D 11x12b, D/A 2x12b; Number of I/O: 47; Peripherals: Brown-out Detect/Reset, DMA, POR, PWM, WDT; Program Memory Size: 512KB (512K x 8); RAM Size: 128K x 8; Speed: 120MHz; Voltage - Supply (Vcc/Vdd): 1.62 V ~ 3.6 V; PackageVersion: revJ, Jul-2007; PackageReference: 64PS; PackageDescription: 64-Pin Quad Flat No-Lead (QFN) Sawn, 9 x 9 x 1.0 mm Body, 0.5 mm Pitch, Exposed Pad; Code_JEDEC: MO-220VMMD-3; ComponentLink1Description: Manufacturer URL; ComponentLink1URL: http://www.atmel.com/; ComponentLink2Description: SAM4S Series Datasheet; ComponentLink2URL: http://www.atmel.com/dyn/resources/prod_documents/11100.pdf; ComponentLink3Description: SAM4S Series Summary; ComponentLink3URL: http://www.atmel.com/dyn/resources/prod_documents/11100S.pdf; Supplier 1: Digi-Key; Package / Case: 64-LQFP; Packaging: Cut Tape (CT); Program Memory Type: FLASH; Supplier Part Number 1: ATSAM4S8BA-ANRCT-ND
Y1 = XT_CRYSTAL_12MHz_18pF: CRYSTAL 12MHZ 18PF 6X3.5mm SMD; Manufacturer: CTS-Frequency Controls; Manufacturer Part Number: 406C35D12M00000; ESR (Equivalent Series Resistance): 60 Ohm; Frequency Stability: ±50ppm; Frequency Tolerance: ±30ppm; Operating Mode: Fundamental; Supplier 1: Digi-Key; Height: 0.047" (1.20mm); Load Capacitance: 18pF; Mounting Type: Surface Mount; Operating Temperature: -20°C ~ 70°C; Package / Case: 4-SMD, No Lead (DFN, LCC); Size / Dimension: 0.236" L x 0.138" W (6.00mm x 3.50mm); Supplier Part Number 1: CTX855CT-ND; Frequency: 12MHz

## Sheet IMU_Radio.SchDoc: Wacky Hat Schematic
size A3; DrawnBy: A. Finlayson, H. Pollard; Organization: Group 17; Address1: ECE Department; Address2: University of Canterbury; Address3: Christchurch 8041; Address4: New Zealand; Revision: 1; SheetNumber: 1; SheetTotal: 3
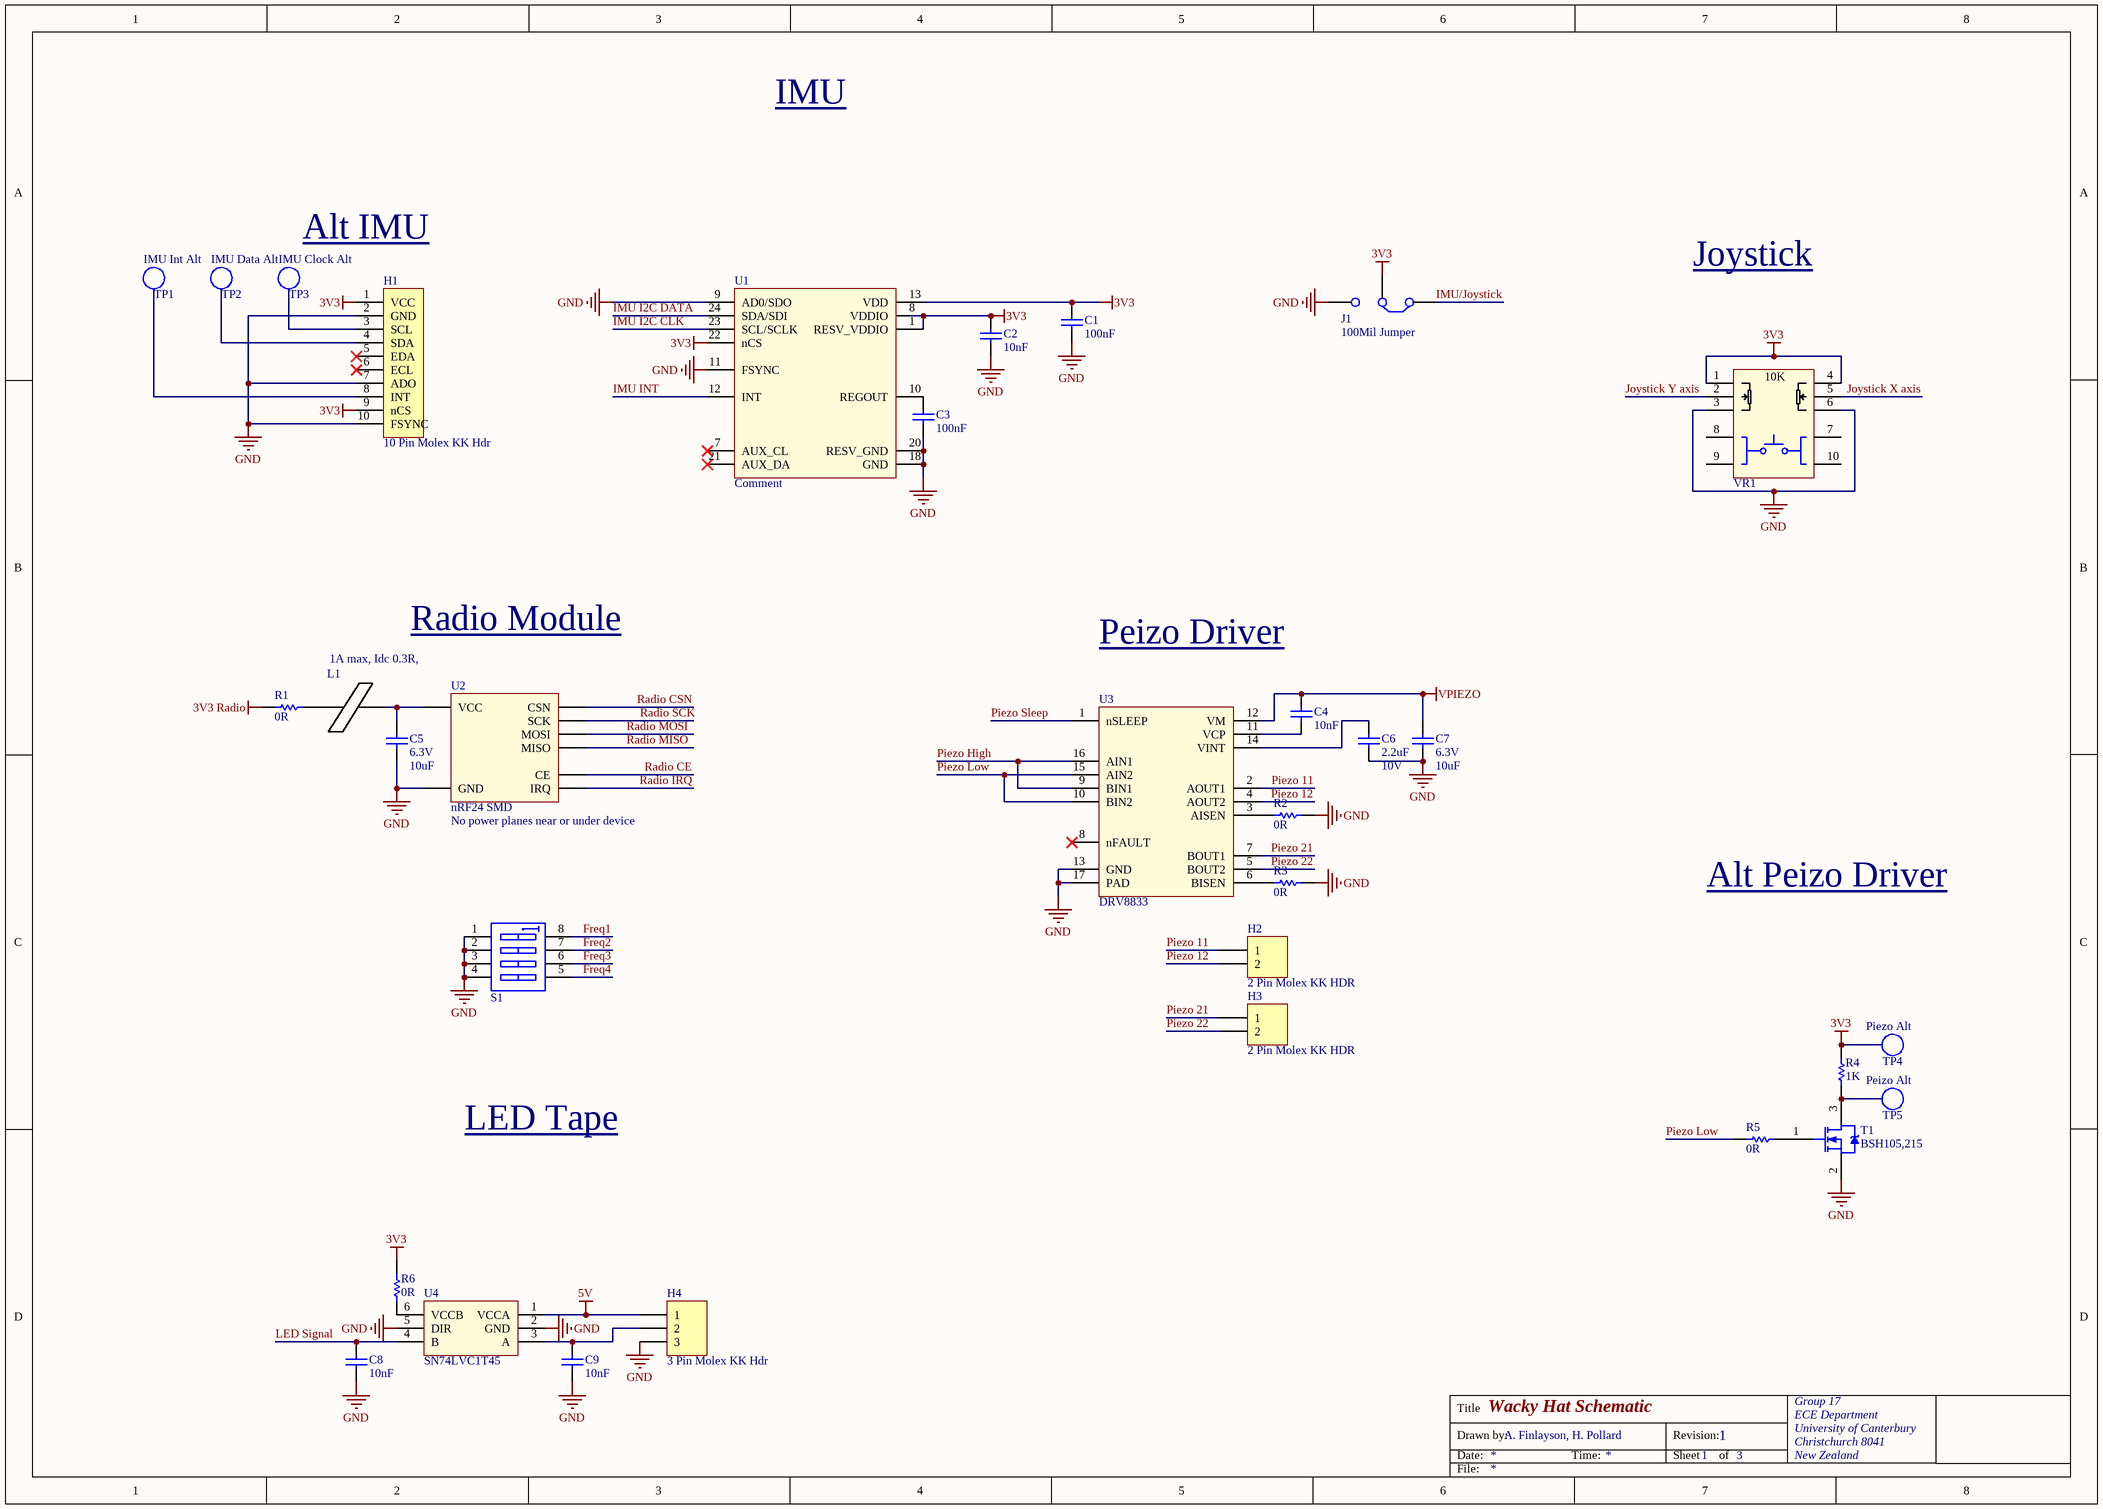
[diagram p2: IMU_Radio.SchDoc]

### Parts
C1  100nF  [CAPC1608L]
C2  10nF  [CAPC1608L]
C3  100nF  [CAPC1608L]
C4  10nF  [CAPC1608L]
C5  Voltage - Rated: 6.3V  [CAPC1608L]  (hidden comment: 10uF)
C6  Max Voltage: 10V  [CAPC1608L]  (hidden comment: 2.2uF)
C7  Voltage - Rated: 6.3V  [CAPC1608L]  (hidden comment: 10uF)
C8  10nF  [CAPC1608L]
C9  10nF  [CAPC1608L]
H1  10 Pin Molex KK Hdr  [MOLEX_KK_10_HDR]
H2  2 Pin Molex KK HDR  [MOLEX_KK_2_HDR]
H3  2 Pin Molex KK HDR  [MOLEX_KK_2_HDR]
H4  3 Pin Molex KK Hdr  [MOLEX_KK_3_HDR]
J1  100Mil Jumper  [JMP2.54-CO]
L1  1A max, Idc 0.3R,  [INDC3216L]
R1  0R  [RESC1608L]
R2  0R  [RESC1608L]
R3  0R  [RESC1608L]
R4  1K  [RESC1608L]
R5  0R  [RESC1608L]
R6  0R  [RESC1608L]
S1  WS_SW DIP-4  [DIP_SW_4WAY_SMD -]  (value not drawn)
T1  BSH105,215  [SOT23_L]
TP1  IMU Int Alt  [TP_0603]
TP2  IMU Data Alt  [TP_0603]
TP3  IMU Clock Alt  [TP_0603]
TP4  Piezo Alt  [TP_0603]
TP5  Peizo Alt  [TP_0603]
U1  Comment  [Quad24]
U2  nRF24 SMD  Warning: No power planes near or under device  [NRF24]
U3  DRV8833  [HTSOP16]
U4  SN74LVC1T45  [SOT23-6_N]
VR1  Joystick 10k with Sw  [Joystick_Sw]  (value not drawn)

### Nets
3V3: C1.2 C2.2 H1.1(VCC) H1.9(nCS) J1.2(C2) R4.2 R6.2 TP4.1(TP) U1.1(RESV_VDDIO) U1.8(VDDIO) U1.13(VDD) U1.22(nCS) VR1.1 VR1.4(1')
3V3 Radio: R1.1
5V: H4.1 U4.1(VCCA)
GND: C1.1 C2.1 C3.1 C5.1 C6.2 C7.1 C8.1 C9.1 H1.2(GND) H1.7(ADO) H1.10(FSYNC) H4.3 J1.3(C3) R2.2 R3.2 S1.1(A1) S1.2(A2) S1.3(A3) S1.4(A4) T1.2 U1.9(AD0/SDO) U1.11(FSYNC) U1.18(GND) U1.20(RESV_GND) U2.2(GND) U3.13(GND) U3.17(PAD) U4.2(GND) U4.5(DIR) VR1.3 VR1.6(3')
VPIEZO: C4.2 C7.2 U3.12(VM)
Freq1: S1.8(B1)
Freq2: S1.7(B2)
Freq3: S1.6(B3)
Freq4: S1.5(B4)
IMU I2C CLK: U1.23(SCL/SCLK)
IMU I2C DATA: U1.24(SDA/SDI)
IMU INT: U1.12(INT)
IMU/Joystick: J1.1(C1)
Joystick X axis: VR1.5(2')
Joystick Y axis: VR1.2
LED Signal: C8.2 U4.4(B)
Piezo 11: H2.1 U3.2(AOUT1)
Piezo 12: H2.2 U3.4(AOUT2)
Piezo 21: H3.1 U3.7(BOUT1)
Piezo 22: H3.2 U3.5(BOUT2)
Piezo High: U3.9(BIN1) U3.16(AIN1)
Piezo Low: R5.1 U3.10(BIN2) U3.15(AIN2)
Piezo Sleep: U3.1(nSLEEP)
Radio CE: U2.3(CE)
Radio CSN: U2.4(CSN)
Radio IRQ: U2.8(IRQ)
Radio MISO: U2.7(MISO)
Radio MOSI: U2.6(MOSI)
Radio SCK: U2.5(SCK)
NetC3_2: C3.2 U1.10(REGOUT)
NetC4_1: C4.1 U3.11(VCP)
NetC5_2: C5.2 L1.1 U2.1(VCC)
NetC6_1: C6.1 U3.14(VINT)
NetC9_2: C9.2 H4.2 U4.3(A)
NetH1_3: H1.3(SCL) TP3.1(TP)
NetH1_4: H1.4(SDA) TP2.1(TP)
NetH1_8: H1.8(INT) TP1.1(TP)
NetL1_2: L1.2 R1.2
NetR2_1: R2.1 U3.3(AISEN)
NetR3_1: R3.1 U3.6(BISEN)
NetR4_1: R4.1 T1.3 TP5.1(TP)
NetR5_2: R5.2 T1.1
NetR6_1: R6.1 U4.6(VCCB)

Not connected (* = marked no-connect by the designer): H1 5(EDA)* 6(ECL)*; U1 7(AUX_CL)* 21(AUX_DA)*; U3 8(nFAULT)*; VR1 7 8 9 10

### Notes on the sheet
- IMU
- Alt IMU
- Joystick
- Radio Module
- Peizo Driver
- Alt Peizo Driver
- LED Tape
- Title
- Drawn by:
- Date:
- Time:
- Revision:
- Sheet
- of
- File:
- (in symbol Joystick 10k with Sw) 10K

### Library data of the parts
C1 C3 = CC_100nF_0603: CAP CER 100nF X7R +-10% 50V 0603; PackageReference: 0603; Code_IPC: 1608 [0603]; Verify: *; Supplier: ECE Dept; Storage Location: PCB Assembly WS; Value: 100nF
C2 C4 C8 C9 = CC_10nF_0603: CAP CER 10nF X7R +-10% 50V 0603; PackageReference: 0603; Code_IPC: 1608 [0603]; Verify: *; Supplier: ECE Dept; Storage Location: PCB Assembly WS; Value: 10nF
C5 C7 = CC_10uF_0603: CAP CER 10UF X5R +-20% 6V3 0603; Supplier: ECE Dept; Storage Location: PCB Assembly WS; Value: 10uF
C6 = CC_2.2uF_0603: CAP CER 2.2uF X5R +-20% 10V 0603; PackageReference: 0603; Code_IPC: 1608 [0603]; Verify: *; Supplier: ECE Dept; Storage Location: PCB Assembly WS; Value: 2.2uF
H1 = JA_MOLEX_KK_10POS: CONN HEADER 10POS 2.54mm VERT_ Thru Hole; Supplier 1: Farnell; Supplier Part Number 1: 1756828; Supplier: ECE Dept; Storage Location: ECE Dept Store; Value: 10 Pin Molex KK Hdr
H2 H3 = JA_MOLEX_KK_2POS: CONN HEADER 2POS 2.54mm VERT_Thru Hole; Supplier 1: Farnell; Supplier Part Number 1: 1462926; Supplier: ECE Dept; Storage Location: ECE Dept Store; Value: 2 Pin Molex KK HDR
H4 = JA_MOLEX_KK_3POS: CONN HEADER 3POS 2.54mm VERT_Thru Hole; Manufacturer: Molex; Manufacturer PN: 22-23-2031; Supplier Part Number 1: 9731156; Supplier: ECE Dept; Supplier 1: Farnell; Storage Location: ECE Dept Store; Value: 3 Pin Molex KK Hdr
J1 = TP_JUMPER_CO: 2.54mm Jumper change over, Thru Hole; Supplier: ECE Dept; Storage Location: ECE$ Store
L1 = IN_Ferrite-Bead: as L3 on sheet SAM4S_Piezo_LED; Supplier: ECE Dept; Storage Location: PCB Assembly WS; Ferrite Mounting: SMD; Supplier 1: Farnell; Supplier Part Number 1: 1612060; Manufacturer Part Number: 2512066017Y1; Value: 1A max, Idc 0.3R,
R1-R3 R5 R6 = RS_0R0: RES 0.0 OHM 1/10W 5% 0603 SMD; Storage Location: PCB Assembly WS; Supplier: ECE Dept; Value: 0R
R4 = RS_1K: RES 1.0K OHM 1/10W 5% 0603 SMD; Storage Location: PCB Assembly WS; Supplier: ECE Dept; Value: 1K
S1 = WS_SW DIP-4: DIP Switch, 4 Position, SPST SMD; Manufacturer: OMRON ELECTRONIC COMPONENTS; Manufacturer Part Number: A6SN-4101; Contact Current DC Max: 25; External Length / Height: 12.1; No. of Switch Positions: 4; Pitch Spacing: 2.54; Contact Configuration: SPST; Supplier 1: Farnell; Supplier Part Number 1: 2029425; Storage Location: PCB Assembly WS; Supplier: ECE Dept
T1 = TM_BSH105: MOSFET N-CH 20V 1.05A SOT-23; Manufacturer: NXP Semiconductors; FET Type: MOSFET N-Channel, Metal Oxide; Gate Charge (Qg) @ Vgs: 3.9nC @ 4.5V; Input Capacitance (Ciss) @ Vds: 152pF @ 16V; Power - Max: 417mW; Rds On (Max) @ Id, Vgs: 200 mOhm @ 600mA, 4.5V; Supplier 1: Farnell; Supplier 2: Digi-Key; Current - Continuous Drain (Id) @ 25° C: 1.05A; Drain to Source Voltage (Vdss): 20V; Package / Case: TO-236-3, SC-59, SOT-23-3; Pricing: 1=0.53, 10=0.42, 25=0.3544, 100=0.2885, 250=0.23896, 500=0.1974, 1000=0.14785 (NZD); Supplier Part Number 1: 1758066; Supplier Part Number 2: 568-6215-1-ND; Storage Location: PCB Assembly WS; Supplier: ECE Dept; Manufacturer Part Number: BSH105,215
TP1-TP5 = TP_0603: as TP6 on sheet SAM4S_Piezo_LED; Supplier 1: Digi-Key; Mounting Type: Surface Mount; Terminal: 0.063" x 0.031" x 0.045" (1.60mm x 0.80mm x 1.15mm); Type: PC Test Point; Supplier Part Number 1: A106145CT-ND
U1 = MPU-9250: 9 axis IMU
U2 = NRF24: nRF24 SMD Module
U3 = DRV8833: Dual H-Bridge Motor Driver 1.5A
U4 = SN74LVC1T45: 1.8V - 5V level converter
VR1 = Joystick 10k with Sw: JOYSTICK 10K OHM 2 AXIS TH; Manufacturer 1: SparkFun; Manufacturer Part Number 1: COM-09032; Supplier 1: Digi-Key; Stock 1: 563; Pricing 1: 1=3.95000 (USD); RoHS: No; ComponentLink1URL: https://media.digikey.com/pdf/Data%20Sheets/Sparkfun%20PDFs/COM-09032_Web.pdf?src-supplier=Digi-Key; ComponentLink1Description: https://media.digikey.com/pdf/Data%20Sheets/Sparkfun%20PDFs/COM-09032_Web.pdf?src-supplier=Digi-Key; Supplier Part Number 1: 1568-1526-ND

## Nets that join several sheets
3V3: Power_USB (7 pins), SAM4S_Piezo_LED (19 pins), IMU_Radio (14 pins)
3V3 Radio: Power_USB (C16.2 U6.5), SAM4S_Piezo_LED (TP16.1), IMU_Radio (R1.1)
5V: Power_USB (7 pins), SAM4S_Piezo_LED (TP18.1), IMU_Radio (H4.1 U4.1)
GND: Power_USB (31 pins), SAM4S_Piezo_LED (26 pins), IMU_Radio (31 pins)
VBATT: Power_USB (5 pins), SAM4S_Piezo_LED (TP21.1)
VBUS: Power_USB (H6.1 R11.2), SAM4S_Piezo_LED (TP19.1)
VPIEZO: Power_USB (F1.2), SAM4S_Piezo_LED (TP17.1), IMU_Radio (C4.2 C7.2 U3.12)
3V3 Breakout 1: Power_USB (D4.2 D6.1 R19.1), SAM4S_Piezo_LED (U10.14)
3V3 Breakout 2: Power_USB (D5.2 D7.1 R18.1), SAM4S_Piezo_LED (U10.13)
5V Breakout 1: Power_USB (U7.4), SAM4S_Piezo_LED (U10.16)
5V Breakout 2: Power_USB (U8.4), SAM4S_Piezo_LED (U10.15)
D_N: Power_USB (H6.2), SAM4S_Piezo_LED (R21.1)
D_P: Power_USB (H6.3), SAM4S_Piezo_LED (R20.1)
Freq1: SAM4S_Piezo_LED (U10.29), IMU_Radio (S1.8)
Freq2: SAM4S_Piezo_LED (U10.30), IMU_Radio (S1.7)
Freq3: SAM4S_Piezo_LED (U10.31), IMU_Radio (S1.6)
Freq4: SAM4S_Piezo_LED (U10.32), IMU_Radio (S1.5)
IMU I2C CLK: SAM4S_Piezo_LED (R22.1 TP32.1 U10.36), IMU_Radio (U1.23)
IMU I2C DATA: SAM4S_Piezo_LED (R23.1 TP27.1 U10.43), IMU_Radio (U1.24)
IMU INT: SAM4S_Piezo_LED (TP28.1 U10.44), IMU_Radio (U1.12)
IMU/Joystick: SAM4S_Piezo_LED (U10.41), IMU_Radio (J1.1)
Joystick X axis: SAM4S_Piezo_LED (U10.4), IMU_Radio (VR1.5)
Joystick Y axis: SAM4S_Piezo_LED (U10.3), IMU_Radio (VR1.2)
LED Signal: SAM4S_Piezo_LED (TP24.1 U10.35), IMU_Radio (C8.2 U4.4)
Piezo 11: SAM4S_Piezo_LED (TP15.1), IMU_Radio (H2.1 U3.2)
Piezo 12: SAM4S_Piezo_LED (TP14.1), IMU_Radio (H2.2 U3.4)
Piezo 21: SAM4S_Piezo_LED (TP13.1), IMU_Radio (H3.1 U3.7)
Piezo 22: SAM4S_Piezo_LED (TP12.1), IMU_Radio (H3.2 U3.5)
Piezo High: SAM4S_Piezo_LED (TP29.1 U10.48), IMU_Radio (U3.9 U3.16)
Piezo Low: SAM4S_Piezo_LED (TP22.1 U10.49), IMU_Radio (R5.1 U3.10 U3.15)
Piezo Sleep: SAM4S_Piezo_LED (U10.34), IMU_Radio (U3.1)
Radio CE: SAM4S_Piezo_LED (U10.26), IMU_Radio (U2.3)
Radio CSN: SAM4S_Piezo_LED (U10.28), IMU_Radio (U2.4)
Radio IRQ: SAM4S_Piezo_LED (U10.25), IMU_Radio (U2.8)
Radio MISO: SAM4S_Piezo_LED (TP25.1 U10.27), IMU_Radio (U2.7)
Radio MOSI: SAM4S_Piezo_LED (TP26.1 U10.22), IMU_Radio (U2.6)
Radio SCK: SAM4S_Piezo_LED (TP31.1 U10.21), IMU_Radio (U2.5)
USB_Detect: Power_USB (R11.1 R14.2), SAM4S_Piezo_LED (U10.10)
VBATT Detection: Power_USB (R12.1 R15.2), SAM4S_Piezo_LED (U10.9)